# EAGLE board Attenuverting_LinExp_VCA_Bottom (EAGLE 8.3.2)
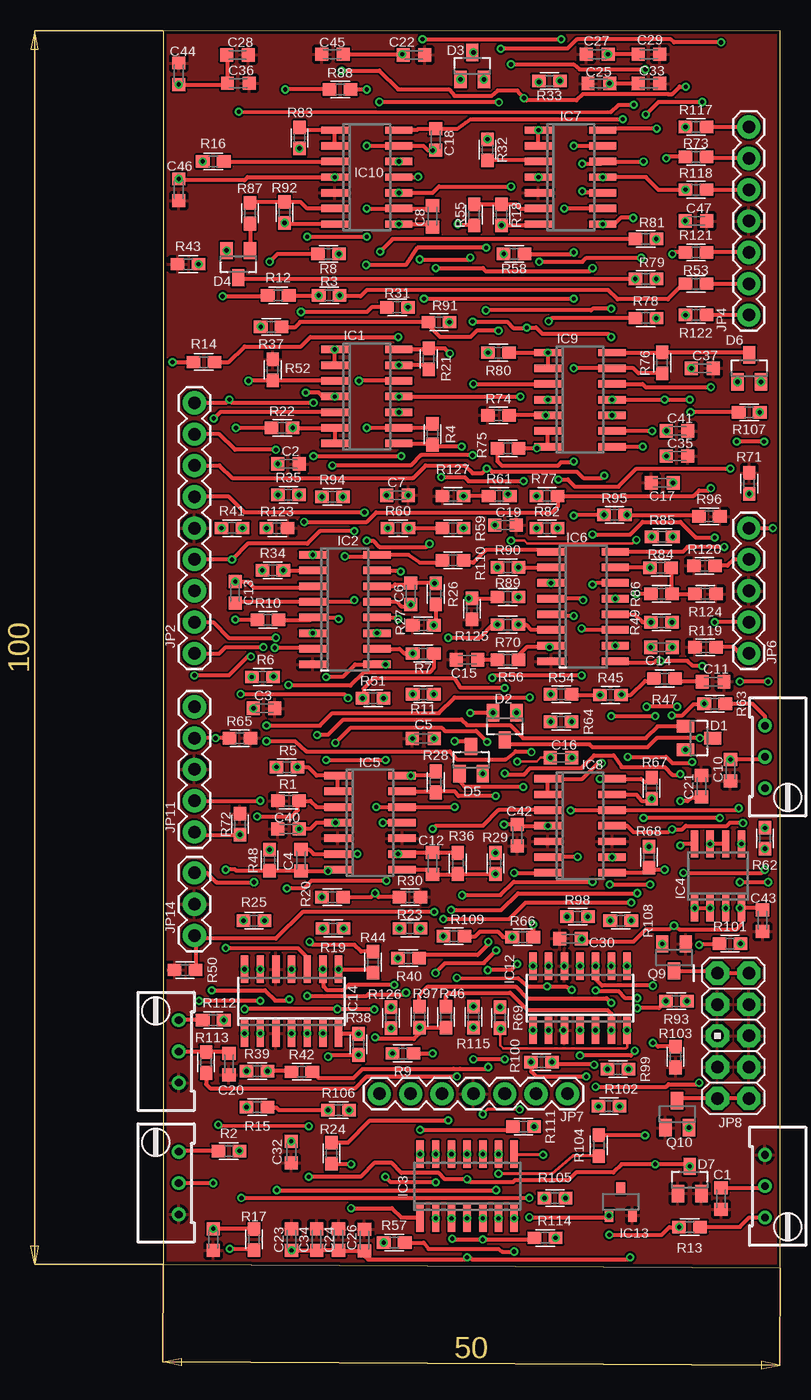
[diagram p5: board, top side]
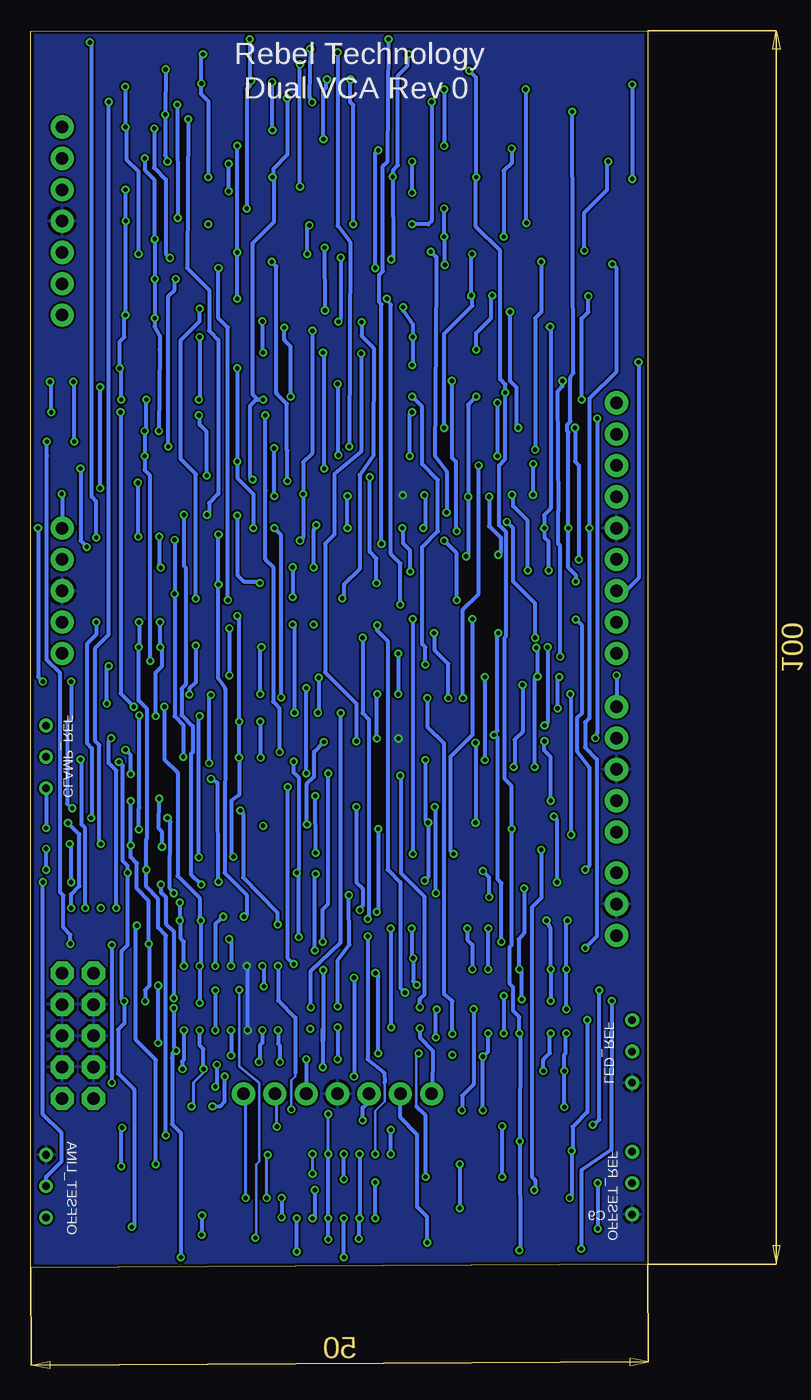
[diagram p6: board, bottom side, seen from below]

Size 50 x 100.25 mm. Coordinates in mm from the lower left corner, seen from the top.
Outline: 0,0.25 50,0 50,100.22 0,100.25 0,0.25
Copper layers (1*16): Top 0.035mm / dielectric 1.5mm / Bottom 0.035mm
Design rules "SeeedStudio_2layer_DRU_no_angle_20140221": minimum track width 6mil, minimum drill 12mil, track to track 6mil, track to pad 6mil, pad to pad 6mil, via to via 6mil, smd to smd 0mil, copper to edge 10mil, drill to drill 10mil, minimum pad ring 10mil, minimum via ring 6mil, stop-mask expansion 2mil, vias tented up to drill 100mil, thermal gap 10mil

## Footprints (pad centres in the part's own frame; a part is rotated, then mirrored left to right if it is on the bottom)
C0603K = smd 1.05 x 1.08: 1 -0.875,0; 2 0.875,0
RTRIM64W = drill 0.61: 1 1.27,-2.54; 2 1.27,0; 3 1.27,2.54
SOT23 = smd 1 x 1.4: 1 -0.95,-1.1; 2 0.95,-1.1; 3 0,1.1
SO14 = smd 0.6 x 2.2: 1 -3.81,-2.6; 2 -2.54,-2.6; 3 -1.27,-2.6; 4 0,-2.6; 5 1.27,-2.6; 6 2.54,-2.6; 7 3.81,-2.6; 8 3.81,2.6; 9 2.54,2.6; 10 1.27,2.6; 11 0,2.6; 12 -1.27,2.6; 13 -2.54,2.6; 14 -3.81,2.6
SOIC16N = smd 0.6 x 2.2: 1 -4.445,-2.6; 2 -3.175,-2.6; 3 -1.905,-2.6; 4 -0.635,-2.6; 5 0.635,-2.6; 6 1.905,-2.6; 7 3.175,-2.6; 8 4.445,-2.6; 9 4.445,2.6; 10 3.175,2.6; 11 1.905,2.6; 12 0.635,2.6; 13 -0.635,2.6; 14 -1.905,2.6; 15 -3.175,2.6; 16 -4.445,2.6
SO08 = smd 0.6 x 2.2: 1 -1.905,-2.6; 2 -0.635,-2.6; 3 0.635,-2.6; 4 1.905,-2.6; 5 1.905,2.6; 6 0.635,2.6; 7 -0.635,2.6; 8 -1.905,2.6
DBZ_R-PDSO-G3 = smd 0.7 x 1: 1 -0.95,-1.1; 2 0.95,-1.1; 3 0,1.1
1X09 = drill 1.016 pad 1.88: 1 0,0; 2 2.54,0; 3 5.08,0; 4 7.62,0; 5 10.16,0; 6 12.7,0; 7 15.24,0; 8 17.78,0; 9 20.32,0
1X07 = drill 1.016 pad 1.88: 1 0,0; 2 2.54,0; 3 5.08,0; 4 7.62,0; 5 10.16,0; 6 12.7,0; 7 15.24,0
1X05 = drill 1.016 pad 1.88: 1 0,0; 2 2.54,0; 3 5.08,0; 4 7.62,0; 5 10.16,0
AVR_ICSP = drill 1.016 pad 1.88 octagon: 1 -1.27,5.08; 2 1.27,5.08; 3 -1.27,2.54; 4 1.27,2.54; 5 -1.27,0; 6 1.27,0; 7 -1.27,-2.54; 8 1.27,-2.54; 9 -1.27,-5.08; 10 1.27,-5.08
1X03 = drill 1.016 pad 1.88: 1 0,0; 2 2.54,0; 3 5.08,0
0603 = smd 1.1 x 1: 1 -0.85,0; 2 0.85,0

## Placement (x,y rotation side)
C1  4u7  [C0603K]  45.21,5.59 270 top
C2  560p  [C0603K]  10.16,65.15 0 top
C3  560p  [C0603K]  8.19,45.34 0 top
C4  100p  [C0603K]  11.18,33.02 90 top
C5  560p  [C0603K]  21.08,42.89 180 top
C6  100p  [C0603K]  20.07,54.61 270 top
C7  560p  [C0603K]  18.99,62.61 0 top
C8  100p  [C0603K]  21.84,85.22 90 top
C9  4u7  [C0603K]  4.06,2.29 270 top
C10  4u7  [C0603K]  45.97,40.32 270 top
C11  560p  [C0603K]  44.58,47.5 0 top
C12  100p  [C0603K]  21.84,32.77 90 top
C13  100p  [C0603K]  5.84,54.74 270 top
C14  100p  [C0603K]  40.39,50.29 180 top
C15  560p  [C0603K]  24.64,49.28 180 top
C16  100p  [C0603K]  32.26,41.34 0 top
C17  560p  [C0603K]  40.45,63.63 180 top
C18  100p  [C0603K]  22.1,91.44 270 top
C19  560p  [C0603K]  27.75,60.2 0 top
C20  4u7  [C0603K]  5.33,16.51 270 top
C21  100n  [C0603K]  43.62,39.02 90 top
C22  100n  [C0603K]  20.32,98.3 180 top
C23  100n  [C0603K]  10.41,2.29 90 top
C24  100n  [C0603K]  14.22,2.29 90 top
C25  100n  [C0603K]  35.31,95.98 180 top
C26  100n  [C0603K]  16.32,2.22 90 top
C27  100n  [C0603K]  35.18,98.36 180 top
C28  100n  [C0603K]  6.03,98.3 0 top
C29  100n  [C0603K]  39.37,98.36 0 top
C30  100n  [C0603K]  33.02,26.67 180 top
C32  100n  [C0603K]  10.38,9.37 270 top
C33  100n  [C0603K]  39.37,95.98 0 top
C34  100n  [C0603K]  12.45,2.29 90 top
C35  100n  [C0603K]  41.66,65.79 0 top
C36  100n  [C0603K]  6.1,96.01 0 top
C37  100n  [C0603K]  43.69,72.9 0 top
C40  100n  [C0603K]  10.16,35.56 180 top
C41  100n  [C0603K]  41.66,67.82 0 top
C42  100n  [C0603K]  28.7,35.05 270 top
C43  100n  [C0603K]  48.58,28.13 90 top
C44  100n  [C0603K]  1.27,96.77 90 top
C45  100n  [C0603K]  13.72,98.36 180 top
C46  100n  [C0603K]  1.27,87.38 270 top
C47  100n  [C0603K]  43.18,84.84 0 top
CLAMP_REF  [RTRIM64W]  50.04,41.4 180 top
D1  BAT54A  [SOT23]  43.43,42.93 270 top
D2  BAT54A  [SOT23]  27.69,43.88 180 top
D3  BAT54S  [SOT23]  25.05,97.41 0 top
D4  BAT54S  [SOT23]  6.1,81.34 180 top
D5  BAT54S  [SOT23]  24.96,41.15 0 top
D6  BAT54S  [SOT23]  47.5,72.9 0 top
D7  BAT54A  [SOT23]  42.67,7.11 0 top
IC1  TL074D  [SO14]  16.51,70.61 270 top
IC2  SSM2164S  [SOIC16N]  14.73,53.34 270 top
IC3  TL074D  [SO14]  24.64,6.6 0 top
IC4  TL072D  [SO08]  44.96,31.75 0 top
IC5  TL074D  [SO14]  16.76,36.07 270 top
IC6  SSM2164S  [SOIC16N]  34.04,53.59 270 top
IC7  TL074D  [SO14]  33.02,88.39 270 top
IC8  TL074D  [SO14]  33.78,35.81 270 top
IC9  TL074D  [SO14]  33.78,70.36 270 top
IC10  TL074D  [SO14]  16.51,88.39 270 top
IC12  QUAD_OPAMPD  [SO14]  33.78,21.84 0 top
IC13  LM4041C12DBZ  [DBZ_R-PDSO-G3]  37.08,5.33 0 top
IC14  QUAD_OPAMPD  [SO14]  10.41,21.59 0 top
JP2  M09  [1X09]  2.54,49.78 90 top
JP4  [1X07]  47.46,77.22 90 top
JP6  [1X05]  47.46,49.78 90 top
JP7  [1X07]  17.53,14.1 0 top
JP8  M05X2PTH  [AVR_ICSP]  46.19,18.8 0 top
JP11  [1X05]  2.54,35.31 90 top
JP14  [1X03]  2.54,26.92 90 top
LED_REF  [RTRIM64W]  0,17.53 0 top
OFFSET_LINA  [RTRIM64W]  50.04,6.6 180 top
OFFSET_REF  [RTRIM64W]  0,6.86 0 top
Q9  BSS84  [SOT23]  41.4,25.15 180 top
Q10  BSS123  [SOT23]  41.66,12.45 0 top
R1  1M  [0603]  10.16,37.85 180 top
R2  10k  [0603]  5.33,9.46 0 top
R3  10k  [0603]  13.46,78.8 0 top
R4  10k  [0603]  21.84,67.56 270 top
R5  30k  [0603]  10.03,40.58 180 top
R6  500  [0603]  8.06,47.88 0 top
R7  30k  [0603]  21.08,49.78 180 top
R8  4k7  [0603]  13.4,82.17 180 top
R9  10k  [0603]  19.43,17.37 180 top
R10  30k  [0603]  8.51,52.51 180 top
R11  500  [0603]  21.08,46.48 180 top
R12  10k  [0603]  9.33,78.8 180 top
R13  10k  [0603]  42.67,3.3 180 top
R14  4k7  [0603]  3.3,73.41 180 top
R15  100k  [0603]  7.62,13.02 180 top
R16  100k  [0603]  4.06,89.66 0 top
R17  10k  [0603]  7.37,2.29 90 top
R18  100k  [0603]  27.43,85.34 270 top
R19  100k  [0603]  13.78,27.5 180 top
R20  10k  [0603]  13.72,30.04 0 top
R21  10k  [0603]  21.53,73.66 90 top
R22  10k  [0603]  9.65,68.07 180 top
R23  100k  [0603]  20,27.5 0 top
R24  2k7  [0603]  13.65,9.27 270 top
R25  10k  [0603]  7.37,28.13 0 top
R26  100k  [0603]  22.1,54.61 90 top
R27  100k  [0603]  21.08,52.07 180 top
R28  10k  [0603]  22.1,39.37 90 top
R29  10k  [0603]  26.92,32.77 90 top
R30  10k  [0603]  20,30.04 0 top
R31  10k  [0603]  18.99,77.85 0 top
R32  100k  [0603]  26.29,90.61 270 top
R33  100k  [0603]  31.31,96.2 180 top
R34  140k  [0603]  8.89,56.52 0 top
R35  500  [0603]  10.16,62.64 0 top
R36  30k  [0603]  23.88,32.77 270 top
R37  100k  [0603]  8.76,76.26 0 top
R38  100k  [0603]  15.84,18.1 270 top
R39  100k  [0603]  7.62,15.94 0 top
R40  100k  [0603]  19.88,25.08 0 top
R41  100k  [0603]  5.59,59.94 0 top
R42  100k  [0603]  11.24,15.88 0 top
R43  100k  [0603]  2.03,81.34 180 top
R44  560  [0603]  17.02,24.77 270 top
R45  30k  [0603]  36.26,46.42 0 top
R46  100k  [0603]  22.92,20.32 270 top
R47  500  [0603]  40.64,47.75 180 top
R48  10k  [0603]  8.64,33.02 270 top
R49  30k  [0603]  40.39,52.32 0 top
R50  1M  [0603]  1.78,24.13 180 top
R51  560  [0603]  17.02,46.16 0 top
R52  1M  [0603]  8.89,72.77 90 top
R53  10k  [0603]  43.18,79.76 180 top
R54  30k  [0603]  32.26,46.48 180 top
R55  100k  [0603]  25.21,85.34 90 top
R56  500  [0603]  27.94,49.28 0 top
R57  2k7  [0603]  18.73,2.03 0 top
R58  100k  [0603]  28.45,82.17 180 top
R59  140k  [0603]  23.5,59.94 180 top
R60  500  [0603]  19.05,59.94 0 top
R61  100k  [0603]  27.24,62.55 0 top
R62  10k  [0603]  48.77,34.8 270 top
R63  10k  [0603]  44.7,45.72 0 top
R64  30k  [0603]  32.26,44.26 180 top
R65  1M  [0603]  6.22,42.93 0 top
R66  10k  [0603]  29.15,26.8 0 top
R67  10k  [0603]  39.59,38.86 90 top
R68  10k  [0603]  39.37,33.27 90 top
R69  560  [0603]  27.3,20.26 270 top
R70  560  [0603]  27.94,52.13 180 top
R71  10k  [0603]  47.5,63.56 90 top
R72  1M  [0603]  6.22,35.94 90 top
R73  10k  [0603]  43.18,90.04 180 top
R74  1M  [0603]  27.18,69.09 180 top
R75  10k  [0603]  27.94,66.42 180 top
R76  10k  [0603]  40.45,73.34 90 top
R77  10k  [0603]  31.11,62.55 0 top
R78  10k  [0603]  39.12,76.96 0 top
R79  10k  [0603]  39.12,80.14 180 top
R80  10k  [0603]  27.18,74.17 180 top
R81  4k7  [0603]  39.12,83.38 180 top
R82  4k7  [0603]  31.11,59.94 180 top
R83  100k  [0603]  11.05,91.57 90 top
R84  140k  [0603]  40.32,56.74 180 top
R85  500  [0603]  40.45,59.25 180 top
R86  100k  [0603]  40.39,54.61 180 top
R87  100k  [0603]  7.05,85.47 90 top
R88  100k  [0603]  14.35,95.5 180 top
R89  140k  [0603]  27.94,54.36 0 top
R90  500  [0603]  27.94,56.77 0 top
R91  100k  [0603]  22.35,76.64 180 top
R92  100k  [0603]  9.84,85.53 270 top
R93  510  [0603]  41.59,21.59 180 top
R94  6k  [0603]  13.72,62.48 0 top
R95  100k  [0603]  36.58,61.02 180 top
R96  100k  [0603]  44.26,60.9 0 top
R97  100k  [0603]  20.76,20.32 270 top
R98  100k  [0603]  33.59,28.45 180 top
R99  100k  [0603]  36.86,16.1 180 top
R100  100k  [0603]  30.67,16.67 0 top
R101  100k  [0603]  45.94,26.26 0 top
R102  100k  [0603]  36.13,13.08 180 top
R103  100k  [0603]  41.53,17.08 270 top
R104  10k  [0603]  35.31,9.91 270 top
R105  2k7  [0603]  31.75,5.65 0 top
R106  100k  [0603]  14.22,12.76 0 top
R107  100k  [0603]  47.5,69.34 0 top
R108  100k  [0603]  37.08,28.13 180 top
R109  10k  [0603]  23.56,26.86 0 top
R110  6k  [0603]  23.5,57.34 180 top
R111  2k7  [0603]  29.21,11.43 0 top
R112  10k  [0603]  4.06,20.07 0 top
R113  10k  [0603]  3.49,16.64 90 top
R114  10k  [0603]  30.96,2.41 0 top
R115  1k  [0603]  25.15,20.32 270 top
R117  10k  [0603]  43.18,92.46 0 top
R118  10k  [0603]  43.18,87.38 180 top
R119  10k  [0603]  43.94,50.29 180 top
R120  10k  [0603]  43.88,56.9 180 top
R121  10k  [0603]  43.18,82.3 0 top
R122  10k  [0603]  43.18,77.22 180 top
R123  100k  [0603]  9.24,59.94 180 top
R124  100k  [0603]  43.94,54.61 180 top
R125  100k  [0603]  25.02,53.4 90 top
R126  1k  [0603]  18.48,20.26 270 top
R127  100k  [0603]  23.5,62.55 0 top

## Tracks (layer width: path | path; a pad name or v marks a point on that pad's centre or on a via)
+12V  (via drill 0.35)
  Top 0.305: C40.1 11.94,35.56 12.45,36.07 v13.97,36.07 IC5.4 | IC10.4 6.86,88.39 6.6,88.14 1.38,88.14 C46.1 | 42.99,34.29 IC4.8 42.03,34.35 v41.91,34.23 | v14.73,57.66 17.2,57.66 IC2.16 19.88,57.78 20.83,57.15 22.33,57.15 22.39,57.09 R110.2 | R121.1 41.4,82.3 v41.27,82.17 | IC8.4 28.82,35.81 C42.1 | C23.1 C34.1 C24.1 14.29,1.35 C26.1 16.32,0.95 16.61,0.66 24.46,0.66 v24.64,0.83 24.85,0.83 25.02,0.66 37.67,0.66 v37.85,0.83 | v38.42,21.04 40.19,21.04 R93.2 | v38.22,17.58 38.23,17.53 37.9,17.2 v33.78,17.2 | v41.91,37.81 42.51,37.81 42.83,38.13 43.61,38.13 C21.1 | C28.1 5.22,98.23 C36.1 5.11,95.9 C44.1 | v32.04,63.88 32.8,63.88 33.37,63.31 36.89,63.31 38.35,64.77 v45.97,64.77 | v45.47,58.42 42.51,58.42 42.1,58.01 36.67,58.01 IC6.16 | v14.48,97.03 17.53,97.03 19.05,95.5 23.18,95.5 23.63,94.99 26.63,94.99 27.11,95.41 28.7,95.41 v29.24,94.81 29.43,94.62 33.5,94.62 34.02,95.14 40.9,95.14 | v11.56,70.93 12.61,70.93 12.89,70.64 13.88,70.64 IC1.4 | v42.35,95.73 41.85,95.73 41.26,95.14 40.9,95.14 | 40.9,95.14 | C42.1 28.05,35.93 | C42.1 v27.62,35.93 | v13.97,42.54 15.16,43.74 22.61,43.74 22.84,43.51 25.36,43.51 v26.26,42.61
  Bottom 0.305: R93.2 40.74,22.5 40.39,22.86 40.39,26.18 Q9.2 40.45,29.72 41.4,30.73 41.4,32.77 41.91,33.27 v41.91,34.23 v41.91,37.81 | IC1.4 14.57,69.96 R94.2 14.57,57.82 v14.73,57.66 | v41.27,82.17 41.27,88.84 42.23,89.79 42.23,92.35 R117.1 42.33,95.7 v42.35,95.73 | v24.64,0.83 IC3.4 | C23.1 10.35,1.47 C32.1 10.35,18.93 IC14.4 10.41,20.32 10.92,20.83 10.92,22.73 11.18,22.99 11.18,26.03 11.05,26.15 11.05,35.54 C40.1 11.04,39.04 11.59,39.59 11.59,51.08 11.48,51.19 11.48,59.61 12.06,60.19 12.06,65.02 11.56,65.52 v11.56,70.93 11.56,71.6 11.97,72.01 11.97,82.42 13.94,84.39 13.94,88.55 13.91,88.58 | IC12.4 v33.78,17.2 | v37.85,0.83 37.85,10.92 38.54,11.62 38.54,16.99 38.54,17.37 v38.22,17.58 38.42,17.84 v38.42,21.04 | C44.1 C46.1 | v32.04,63.88 32.26,64.11 32.26,69.85 31.75,70.36 IC9.4 31.62,70.36 32.04,70.77 32.04,83.03 30.29,84.77 30.29,88.26 IC7.4 30.35,88.46 30.35,89.06 29.21,90.2 v29.24,94.81 | v45.97,64.77 45.97,58.93 v45.47,58.42 | 13.91,88.58 IC10.4 | 13.91,88.58 13.91,96.46 v14.48,97.03 | v27.62,35.93 27.62,39.23 27.05,39.81 27.05,41.81 v26.26,42.61 | v13.97,42.54 v13.97,36.07
  other vias: 40.74,21.59 40.45,26.25 14.57,62.48 13.91,70.61 42.33,92.46 10.38,10.24 10.41,18.99 24.64,4 10.41,1.41 33.78,19.24 31.18,70.36 30.42,88.39 1.27,95.9 1.27,88.25 31.18,35.81 13.91,88.39 11.04,35.56
-10V  (via drill 0.35)
  Bottom 0.305: 7.87,75.95 8.19,76.26 R37.1 7.87,76.23 7.87,61.53 8.41,60.99 8.41,59.97 R123.2 | R123.2 8.64,59.91 | R123.2 8.35,59.91 8.35,59.15 8.04,58.84 R34.1
  other vias: 8.04,56.52 8.39,59.94 7.91,76.26
-10V1  (via drill 0.35)
  Top 0.305: R61.1 v24.34,62.55
  Bottom 0.305: v24.34,59.94 v24.34,62.55
-10V2  (via drill 0.35)
  Top 0.305: R89.1 26.99,54.25 R125.2 v24.77,54.25
  Bottom 0.305: R91.1 23.2,75.53 22.23,74.55 22.25,65.83 23.37,64.26 23.37,56.64 24.64,55.37 24.64,54.38 v24.77,54.25
  other vias: 23.2,76.64
-10V3
  Top 0.305: 41.26,54.61 R124.2 | 41.26,54.61 R86.1 | R84.1 41.17,54.69 41.26,54.61
-12V  (via drill 0.35)
  Top 0.305: IC4.4 48.43,29.15 C43.2 | IC1.11 v28.96,70.61 | v36.32,75.44 36.07,75.69 30.73,75.69 30.23,76.2 v29.46,76.2 29.43,76.17 28.38,76.17 27.88,76.68 v25.08,76.68 | v43.69,48.77 42.93,48.77 42.48,49.18 v40.32,49.18 39.94,49.18 39.78,49.02 36.76,49.02 IC6.9 | IC9.11 v40.64,70.36 v42.67,70.36 | IC7.11 39.12,88.39 40.13,87.38 R118.2 | IC4.4 46.86,27.81 46.48,27.43 41.81,27.43 41.5,27.65 v41.4,27.72 41.37,27.72 41.02,27.43 39.12,27.43 38.1,26.42 34.15,26.42 v33.94,26.63 C30.1 | 18.1,48.83 v18.03,48.89 IC2.9 15.56,48.89 14.54,47.88 v13.21,47.88 | v13.21,41.15 v18.03,41.15 | IC5.11 v17.81,36.07 | v18.1,31.37 12.06,31.37 11.43,30.73 v10.03,30.73 | IC8.11 37.59,35.81 38.1,35.31 40.93,35.31 v41.24,35.53 42.07,35.53 42.35,35.81 45.69,35.81 45.94,36.07 46.96,36.07 v46.99,36.04 | v41.21,44.77 42.07,44.77 42.99,45.69 43.82,45.69 R63.1 | D7.3 42.5,8.38 v39.88,8.38 37.15,8.38 36.48,7.71 33.47,7.71 32.83,7.08 28.51,7.08 28.35,6.92 24.89,6.92 v24.64,7.18 22.83,7.18 22.32,7.68 19.3,7.68 18.51,8.48 17.11,8.48 16,7.37 v11.81,7.37 | v11.81,11.46 4.57,11.49 v4.48,11.59 | v3.94,22.48 8.26,22.48 9.08,21.65 9.87,21.65 v10.22,21.75 | IC4.4 v46.74,29.15 | C29.1 C27.1 | C33.1 C25.1 | C45.1 v19.38,98.36 C22.2 | IC10.11 20.64,88.39 v20.67,88.42 | v20.8,81.73 24.73,81.73 v24.89,81.88
  Bottom 0.305: v28.96,70.61 28.96,74.68 29.46,75.18 v29.46,76.2 | v36.32,75.44 36.32,70.42 IC9.11 | R63.1 43.85,48.6 v43.69,48.77 | v40.64,70.36 40.64,67.96 C41.1 C35.1 40.78,64.66 40.39,64.26 40.39,49.34 v40.32,49.18 | v42.67,70.36 42.67,72.76 C37.1 42.81,75.04 42.42,75.44 42.42,77.13 R122.2 42.33,84.81 C47.1 42.3,87.35 R118.2 | D7.3 42.67,11.28 Q10.2 | v13.21,47.88 v13.21,41.15 | v18.03,41.15 18.03,36.29 v17.81,36.07 17.81,31.66 v18.1,31.37 | IC12.11 33.78,26.48 v33.94,26.63 | v10.03,30.73 10.03,27.15 10.48,26.61 10.48,24.25 IC14.11 10.41,24.07 10.26,23.91 10.22,23.91 v10.22,21.75 | v41.24,35.53 41.24,37.24 41.21,37.27 v41.21,44.77 | v24.64,7.18 IC3.11 | v41.4,27.72 41.5,27.4 41.5,18.45 39.88,16.83 v39.88,8.38 | v11.81,7.37 v11.81,11.46 | v4.48,11.59 4.35,11.59 3.94,12 v3.94,22.48 | v46.74,29.15 46.74,30.26 46.07,30.93 46.07,35.11 v46.99,36.04 | v18.03,48.89 18.03,50.29 18.29,50.55 18.29,58.42 17.02,59.69 17.02,63.85 18.29,65.12 18.29,69.79 IC1.11 | C27.1 36.18,98.23 C25.1 36.2,95.81 36.2,95.12 35.62,94.55 IC7.11 | v19.38,98.36 19.46,98.28 19.46,97.41 20.26,96.62 20.26,89.34 20.67,88.93 v20.67,88.42 20.64,81.89 v20.8,81.73 | v24.89,81.88 24.89,76.87 v25.08,76.68
  other vias: 42.61,11.35 36.38,70.36 43.85,45.72 40.78,67.82 42.81,72.9 42.33,77.22 42.3,84.84 42.33,87.38 40.78,65.79 42.67,8.21 33.78,24.44 10.41,24.19 24.64,9.2 19.11,70.61 36.18,95.98 36.05,98.36 35.62,88.39
CLAMP_REF  (via drill 0.35)
  Top 0.305: IC4.2 v43.08,29.15 IC4.1 | D1.3 v43.5,42.93 40.01,42.93 39.24,42.16 34.8,42.16 34.54,42.42 28.05,42.42 D2.3
  Bottom 0.305: v43.08,29.15 43.08,40.28 43.69,40.89 43.69,42.67 v43.5,42.93
  other vias: 44.32,29.15
CV_1+  (via drill 0.35)
  Top 0.305: 13.91,67.88 IC1.6 | 13.91,67.88 IC1.7 | R22.1 13.71,68.07 13.91,67.88 | R31.1 16.89,77.85 16.51,77.47 v11.18,77.47
  Bottom 0.305: v11.18,77.47 11.18,71.88 10.67,71.37 10.67,68.24 R22.1
  other vias: 10.5,68.07
CV_1+1  (via drill 0.35)
  Top 0.305: 31.18,66.69 IC9.6 | 31.18,66.69 IC9.7 | R75.1 v30.29,66.42 30.91,66.42 31.18,66.69
  Bottom 0.305: v30.29,66.42 30.27,66.4 v30.27,62.55
CV_1-  (via drill 0.35)
  Top 0.305: IC1.2 IC1.1 | R12.1 R3.1
  Bottom 0.305: IC1.1 13.91,75.75 12.7,76.96 12.7,78.72 R3.1
  other vias: 12.61,78.8 13.91,74.42
CV_1-1  (via drill 0.35)
  Top 0.305: IC9.2 IC9.1 R80.1 | v31.24,76.71 31.5,76.96 R78.1
  Bottom 0.305: v31.24,76.71 31.24,74.23 IC9.1
  other vias: 31.18,74.17
CV_EXPA  (via drill 0.35)
  Top 0.305: R65.1 v4.25,42.93 JP11.4 | IC1.5 4.61,69.34 v4.11,68.83
  Bottom 0.305: v4.11,68.83 4.11,43.39 v4.25,42.93
CV_EXPB  (via drill 0.35)
  Top 0.305: IC9.5 v31.01,69.09 R74.1 | JP11.2 v7.87,37.85 | v8.38,42.67 10.67,42.67 11.62,41.85 23.24,41.85 23.81,41.21 27.75,41.21 28.57,41.85 29.78,41.85 v29.84,41.79
  Bottom 0.305: v7.87,37.85 7.87,41.4 8.38,41.91 v8.38,42.67 | 30.99,69.07 v31.01,69.09 31.02,68.35 31.02,63.85 30.99,62.99 30.99,57.4 30.38,56.79 30.38,45.87 29.84,45.34 v29.84,41.79
CV_LINA  (via drill 0.35)
  Top 0.305: IC1.3 13.87,71.92 R52.1 6.96,71.92 v6.92,71.88 | v7.11,49.53 6.86,49.53 5.33,48.01 v2.54,48.01
  Bottom 0.305: v6.92,71.88 6.92,71.44 7.3,71.06 7.24,61.34 7.27,61.31 7.27,58.67 7.11,58.52 v7.11,49.53 | v2.54,48.01 JP11.5
CV_LINB  (via drill 0.35)
  Top 0.305: R72.1 2.75,35.09 JP11.1 | v25.15,71.63 IC9.3 | v25.08,65.85 20.89,65.85 20.07,65.02 v13.72,65.02 | v6.29,46.48 14.67,46.48 v14.99,46.16
  Bottom 0.305: R72.1 6.22,46.1 v6.29,46.48 | v14.99,46.16 14.99,53.34 13.72,54.61 v13.72,65.02 | v25.08,65.85 25.08,71.57 v25.15,71.63
  other vias: 6.22,35.09
CV_SUM+_A  (via drill 0.35)
  Top 0.305: R38.1 14.27,18.95 IC14.7
  Bottom 0.305: R51.2 17.87,43.84 16.51,42.48 16.51,22.16 15.84,21.62 R38.1
  other vias: 17.87,46.16 15.84,18.95
CV_SUM+_B  (via drill 0.35)
  Top 0.203: R69.2 27.3,18.03 27.56,17.78 37.5,17.78 37.59,17.84 IC12.7
  Top 0.305: R69.2 v27.36,19.35
  Bottom 0.305: IC12.7 37.59,16.86 37.75,16.7 37.75,16.14 R99.1
  other vias: 37.59,19.24 37.71,16.1
CV_SUM-_A  (via drill 0.35)
  Top 0.305: 14.28,24.13 IC14.8 17.29,24.19 R44.2
  Bottom 0.305: R19.1 14.63,26.57 14.22,26.16 IC14.8
  other vias: 14.63,27.5 14.22,24.19
CV_SUM-_B  (via drill 0.35)
  Top 0.305: R70.2 26.73,52.13 25.65,51.05 v23.11,51.05 | v22.7,28.26 28.04,28.26 29.37,29.59 v37.94,29.59
  Bottom 0.305: IC12.8 37.59,26.42 37.85,26.67 37.85,28.36 R108.1 37.94,29.46 v37.94,29.59 | v23.11,51.05 23.11,44.96 22.61,44.45 22.61,28.45 v22.7,28.26
  other vias: 37.93,28.13 37.59,24.44 27.09,52.13
EXP_NEG_A  (via drill 0.35)
  Top 0.305: 26.35,26.32 v26.35,26.42 26.35,26.19 25.5,25.34 20.98,25.34 R40.2
  Bottom 0.305: D5.2 25.91,40.3 25.91,29.46 26.35,29.02 v26.35,26.42
  other vias: 25.91,40.05
EXP_NEG_B  (via drill 0.35)
  Bottom 0.305: R107.2 48.35,71.7 D6.2
  other vias: 48.35,69.34 48.45,71.8
EXP_POS_A  (via drill 0.35)
  Top 0.305: R42.2 12.6,15.37 15.43,15.37 16.16,16.1 23.55,16.12 23.55,16.13 24.07,16.13 24.08,16.12 26.23,16.13 v26.35,16.26 | v29.18,38.96 24.45,38.96 24.13,39.37 24.13,40.18 D5.1 | v28.7,24.61 28.23,24.13 26.33,24.13 v26.31,24.11
  Bottom 0.305: 26.35,18.36 v26.35,16.26 | 26.35,18.36 26.35,19.3 | v29.18,38.96 29.21,38.99 29.21,25.11 v28.7,24.61 | v26.31,24.11 26.31,18.4 26.35,18.36
EXP_POS_B  (via drill 0.35)
  Top 0.305: v48.7,66.96 v46.48,66.96
  Bottom 0.305: R101.2 46.79,26.98 47.37,27.56 47.37,30.16 47.62,30.42 47.62,48.19 48.7,49.27 48.7,65.81 | 48.7,65.81 | 48.7,65.81 v48.7,66.96 | v46.48,66.96 46.48,71.73 D6.1
  other vias: 46.55,71.8 46.79,26.26
GND  (via drill 0.35)
  Top 0.152: IC12.3 v32.44,19.24
  Bottom 0.305: v32.44,19.24 32.44,24.37 IC12.12
  other vias: 19.86,62.61 20.21,42.89 32.51,24.44
  pour Bottom: -3.56,102.11 52.32,102.11 52.32,-1.78 -3.56,-1.78
  pour Top: -2.03,101.6 51.31,101.6 51.31,-0.76 -2.03,-0.76
IC2_2  (via drill 0.35)
  Top 0.305: R46.1 22.92,22.03 23.18,22.29 28.13,22.29 29.53,20.89 36,20.89 36.06,20.83 36.32,20.57 IC12.6
  Bottom 0.254: R99.2 36.04,15.77 36.83,14.99 36.83,13.23 R102.1
  Bottom 0.305: IC12.6 36.32,18.03 36.01,17.72 R99.2
  other vias: 36.98,13.08 36.01,16.1 36.32,19.24
IC2_4  (via drill 0.35)
  Top 0.305: C13.2 5.96,53.97 IC2.4 15.37,53.97 v15.49,54.1 | IC7.9 v32.51,85.85 | v16.51,58.93 17.02,58.93 17.53,58.42 21.34,58.42 v21.59,58.67 | v21.02,99.57 v32.26,99.57
  Bottom 0.305: v32.51,85.85 32.51,95.53 32.26,95.78 | 32.26,95.78 R33.1 | v15.49,54.1 15.49,57.91 v16.51,58.93 | v21.59,58.67 21.59,78.1 21.78,78.29 21.78,80.45 21.47,80.76 21.47,89.28 21.08,89.66 v21.02,99.57 | v32.26,99.57 32.26,95.78
  other vias: 32.16,96.2
IC2_8  (via drill 0.35)
  Top 0.305: R106.1 9.4,12.76 9.21,12.95 8.53,12.95 R15.1 | R38.2 13.52,17.25 v13.37,17.11
  Bottom 0.305: R106.1 v13.37,17.11 12.95,17.53 IC14.6
  other vias: 13.37,12.76 12.95,18.99 15.84,17.25
IC2_13  (via drill 0.35)
  Top 0.305: R58.1 33.15,82.17 v33.27,82.3 | v33.27,90.93 IC7.13 | IC2.13 18.92,53.97 19.3,53.59 19.93,53.59 C6.2 | v21.14,78.55 v33.27,78.55
  Bottom 0.305: v33.27,90.93 v33.27,82.3 v33.27,78.55 | C6.2 20.07,57.09 20.83,57.85 20.83,78.04 v21.14,78.55
  other vias: 20.07,53.73
IC2B_1  (via drill 0.35)
  Top 0.305: IC6.6 29.84,51.69 29.46,52.07 28.85,52.07 R70.1
  Bottom 0.305: D2.1 28.64,51.98 R70.1
  other vias: 28.64,44.98 28.79,52.13
IC2B_6  (via drill 0.35)
  Top 0.305: R44.1 16.04,25.62 15.49,26.16 12.13,26.16 v11.87,26.42 | D1.1 40.07,43.88 39.12,42.93 29.17,42.93 28.12,43.97 26.11,43.97 | v12.48,43.18 13.34,43.18 14.61,44.42 24.16,44.45 24.64,43.97 26.11,43.97 | 26.11,43.97
  Bottom 0.305: v11.87,26.42 11.87,31.15 12.19,31.5 12.19,42.96 v12.48,43.18 12.19,43.53 12.19,51.38 IC2.6
  other vias: 12.13,51.43
IC2C_1  (via drill 0.35)
  Top 0.305: D2.2 24.91,44.98 v24.89,44.96 | v33.91,48.01 26.86,48.01 v26.67,47.82 | IC6.11 34.04,51.69 v33.91,51.82
  Bottom 0.305: R69.1 27.3,24.07 24.89,26.35 v24.89,44.96 | v33.91,51.82 v33.91,48.01 | v26.67,47.82 26.67,45.04 D2.2
  other vias: 27.3,21.11 26.74,44.98
IC2C_11  (via drill 0.35)
  Top 0.305: R51.1 16,46.48 15.75,46.23 15.91,46.23 R51.1 | v27.69,46.99 24.13,46.99 23.62,47.75 17.02,47.75 16.26,46.93 16.26,46.57 R51.1 | v27.69,40.07 27.81,39.94 29.21,39.94 29.76,40.49 33.89,40.49 34.92,41.53 36.51,41.53 37.15,40.58 40.64,40.58 41.27,39.94 41.85,39.94 v41.91,40
  Bottom 0.305: R51.1 16.17,48.93 17.27,50.04 17.27,51.38 IC2.11 | v27.69,40.07 v27.69,46.99 | v41.91,40 41.91,41.55 D1.2
  other vias: 16.17,46.16 17.33,51.43 42.33,41.98
IC6_4  (via drill 0.35)
  Top 0.305: C18.2 v21.84,90.57 21.45,90.57 21.08,90.93 IC10.13 v16.51,90.93 | R88.1 v16.51,95.5 | IC6.4 33.91,54.23 v34.04,54.1 | v22.1,81.03 25.91,81.03 26.16,80.77 34.54,80.77 v34.8,81.03
  Bottom 0.305: v16.51,95.5 v16.51,90.93 | v34.04,54.1 34.04,76.2 34.8,76.96 v34.8,81.03 | v22.1,81.03 22.1,90.31 v21.84,90.57
IC6_13  (via drill 0.35)
  Top 0.305: C8.2 21.6,85.85 IC10.9 v16.51,85.85 | v11.68,83.57 v16.51,83.57 | v36.32,77.72 34.8,77.72 34.67,77.6 v26.16,77.6 | v26.19,82.68 20.61,82.68 19.65,81.28 v16.45,81.28
  Bottom 0.305: R83.1 11.05,89.54 11.68,88.9 v11.68,83.57 | v16.51,85.85 v16.51,83.57 16.45,83.5 v16.45,81.28 | IC6.13 36.64,64.32 37.85,65.53 37.85,75.18 36.32,76.71 v36.32,77.72 | v26.16,77.6 v26.19,82.68
  other vias: 11.05,90.72 36.64,54.23
IN1  (via drill 0.35)
  Top 0.305: R45.1 33.17,46.42 R54.1 | IC8.2 IC8.1 33.98,39.62 35.25,40.89 35.24,40.89 v35.56,40.89
  Bottom 0.305: v35.56,40.89 35.56,46.25 R45.1
  other vias: 35.41,46.42
IN2  (via drill 0.35)
  Top 0.305: R5.1 11.75,40.58 12.45,39.88 IC5.1 IC5.2 | R7.1 21.93,48.6 21.59,48.26 16.26,48.26 15.18,47.18 10.22,47.18 v10.16,47.24
  Bottom 0.305: v10.16,47.24 10.16,43.43 10.79,42.8 10.79,40.66 R5.1
  other vias: 10.88,40.58
IN_A  (via drill 0.35)
  Top 0.305: IC5.3 12.45,37.34 11.94,37.85 R1.1 10.92,37.76 10.92,37.08 10.41,36.58 v7.62,36.58 | JP14.3 3.56,32 4.32,31.24 v7.37,31.24
  Bottom 0.305: v7.37,31.24 7.37,36.32 v7.62,36.58
IN_B  (via drill 0.35)
  Top 0.305: 2.63,26.84 R50.1 | 2.63,26.84 JP14.1 | IC8.3 27.18,37.08 25.91,35.81 22.1,35.81 v21.84,35.56 | v21.97,28.83 11.3,28.83 9.14,26.67 2.79,26.67 2.63,26.84
  Bottom 0.305: v21.84,35.56 21.84,28.96 v21.97,28.83
INV_A  (via drill 0.35)
  Top 0.305: JP6.2 v44.7,52.32 | v17.27,37.34 IC5.12 v23.62,37.34 | v45.12,36.45 v38.92,36.45 | v23.34,28.99 27.4,28.99 28.77,30.35 v38.42,30.35 | R20.2 16.86,30.04 17.17,30.34 | 17.17,30.34 v17.18,30.35 | R30.1 17.47,30.04 17.17,30.34
  Bottom 0.305: v44.7,52.32 44.7,51.31 45.47,50.55 45.47,42.51 45.05,42.1 45.09,36.48 v45.12,36.45 | v17.18,30.35 17.18,37.3 v17.27,37.34 | v23.62,37.34 23.62,31.24 23.11,30.73 23.11,29.34 v23.34,28.99 | v38.42,30.35 38.73,30.73 38.7,36.13 v38.92,36.45
INV_B  (via drill 0.35)
  Top 0.305: v33.02,37.05 36.35,37.05 IC8.12 46.42,37.08 v46.64,37.24 | JP6.5 v49.42,59.94 | v49.02,47.5 v46.74,47.5
  Top 0.406: R66.2 v30,27.81
  Bottom 0.305: JP6.5 47.46,62.68 R71.1 | v30,27.81 30,28.76 32.8,31.62 32.8,36.83 v33.02,37.05 | v49.42,59.94 49.42,47.89 v49.02,47.5 | v46.74,47.5 46.74,44.48 47.05,44.16 47.05,37.59 v46.64,37.24
  other vias: 47.5,62.71
LED_A+  (via drill 0.35)
  Top 0.305: R24.1 14.95,10.12 16.76,11.94 v23.11,11.94
  Bottom 0.305: v23.11,11.94 23.11,12.95 22.61,13.46 JP7.3
LED_A-  (via drill 0.35)
  Bottom 0.305: R57.1 17.88,4.1 18.7,4.92 18.71,10.77 20.07,12.19 JP7.2
  other vias: 17.88,2.03
LED_B+  (via drill 0.35)
  Bottom 0.254: R105.2 32.6,13.93 JP7.7
  other vias: 32.6,5.65
LED_B-  (via drill 0.35)
  Bottom 0.254: R111.2 30.06,13.93 JP7.6
  other vias: 30.06,11.43
LED_VREF  (via drill 0.35)
  Top 0.254: v28.89,12.82 26.28,12.82 v25.91,12.45
  Top 0.305: v23.43,2.35 23.5,2.29 v25.91,2.29 29.98,2.29 R114.1
  Bottom 0.203: 28.57,15.81 28.57,15.49 28.89,15.18 v28.89,12.82 28.89,12.64
  Bottom 0.254: IC3.10 v25.91,12.45
  Bottom 0.305: v25.91,2.29 IC3.5 IC3.10 | IC12.14 29.97,21.65 28.57,20.26 28.57,15.81 | 23.43,3.94 v23.43,2.35 | 23.43,3.94 IC3.3 | IC3.12 IC3.3 | IC3.3 23.43,3.94
  other vias: 25.91,4 29.97,24.44 25.91,9.2 23.37,4 23.37,9.2
LIN+_OUT_A  (via drill 0.35)
  Top 0.305: IC2.14 18.67,55.24 18.8,55.37 19.95,55.37 C6.1 v21.99,55.48 22.02,55.46 R26.2 | v22.54,64.07 24.45,64.07 24.77,63.75 v29.21,63.75 | v30.48,81.53 33.97,81.53 34.29,81.85 v38.73,81.85 | v40.01,92.33 35.75,92.33 IC7.14
  Bottom 0.305: v21.99,55.48 21.99,57.49 22.54,58.04 v22.54,64.07 | v29.21,63.75 29.21,66.19 29.25,66.23 29.25,70.01 30.1,70.86 30.1,81.15 v30.48,81.53 | v40.01,92.33 40.01,89.15 39.05,88.2 39.05,82.17 v38.73,81.85
LIN+_OUT_B  (via drill 0.35)
  Top 0.305: IC10.14 20.57,92.2 20.69,92.32 C18.1 23.83,92.32 24.89,93.09 v37.24,93.09 | R95.2 33.34,61.02 v33.27,60.96
  Bottom 0.305: v37.24,93.09 37.34,81.03 35.56,79.25 35.56,75.95 34.8,75.18 34.8,62.74 35.56,61.98 35.56,61.19 R95.2 | v33.27,60.96 33.27,56.13 32.77,55.63 31.56,55.63 v31.44,55.5
  other vias: 35.73,61.02
LIN-_OUT_A  (via drill 0.35)
  Top 0.305: C13.1 6.87,55.61 7.37,55.12 12.01,55.12 IC2.3 | v6.13,93.69 36.26,93.66 36.92,94.27 v38.13,94.27 | v38.1,85.09 37.08,85.09 36.58,84.58 IC7.8
  Bottom 0.305: C13.1 5.84,56.13 6.44,56.73 R41.2 6.44,67.71 6.54,67.81 6.54,68.33 6.29,68.58 6.29,72.14 6.03,72.52 v6.13,93.69 | v38.13,94.27 v38.1,85.09
  other vias: 6.44,59.94 5.84,55.61 35.62,84.58
LIN-_OUT_B  (via drill 0.35)
  Top 0.305: IC10.8 21.6,84.58 C8.1 | IC6.14 35.18,55.5 v34.8,55.37 | v34.8,59.44 37.85,59.44 38.86,60.45 41.91,60.45 43.18,59.18 v44.7,59.18 | v45.21,99.31 41.4,99.31 41.15,99.57 33.53,99.57 32.77,98.81 v27.37,98.81 | v27.21,94.46 17.72,94.49 v17.53,94.49
  Bottom 0.305: R98.2 32.51,28.54 32.51,30.23 34.29,32 34.26,46.93 34.8,47.75 v34.8,55.37 v34.8,59.44 | v45.21,99.31 45.09,99.19 45.09,62.48 44.7,62.1 v44.7,59.18 | v27.37,98.81 27.43,94.9 v27.21,94.46 | v17.53,94.49 17.53,84.84 17.78,84.58 IC10.8
  other vias: 32.74,28.45 19.11,84.58
LIN_NEG_A  (via drill 0.35)
  Bottom 0.305: R32.1 26.29,95.44 26.07,95.65 26.07,96.29 D3.2
  other vias: 26.29,91.46 26,96.31
LIN_NEG_B  (via drill 0.35)
  Bottom 0.305: D4.2 5.15,85.53 3.3,87.38 3.3,89.57 R16.1
  other vias: 5.15,82.44 3.21,89.66
LIN_POS_A  (via drill 0.35)
  Top 0.305: R55.1 23.96,84.49 v23.88,84.58
  Bottom 0.305: v23.88,84.58 23.88,94.23 24.13,94.49 24.13,96.24 D3.1
  other vias: 24.1,96.31
LIN_POS_B
  Top 0.305: R87.1 D4.1
LINBIASA_1
  Top 0.305: JP4.3 R121.2
LINBIASA_2
  Top 0.305: R53.1 JP4.2
LINBIASA_3
  Top 0.305: JP4.1 R122.1
LINBIASB_1
  Top 0.305: JP4.7 R117.2
LINBIASB_2
  Top 0.305: JP4.6 44.16,89.92 R73.1
LINBIASB_3
  Top 0.305: R118.1 JP4.5
N$1  (via drill 0.35)
  Top 0.305: v5.08,25.91 10.92,25.91 11.68,25.15 IC14.10
  Bottom 0.305: R43.1 2.54,81 2.54,72.64 4.74,70.45 R41.1 4.74,44.54 5.08,44.2 5.08,42.16 4.13,41.21 4.13,26.86 v5.08,25.91
  other vias: 4.74,59.94 2.88,81.34
N$2  (via drill 0.35)
  Top 0.305: v24.19,66.55 22.01,66.55 R4.2 21.76,66.8 IC1.8 | D3.3 v25.15,98.51
  Bottom 0.305: v25.15,98.51 25.15,84.45 24.13,83.12 v24.19,66.55
N$3  (via drill 0.35)
  Top 0.305: R103.1 40.11,17.93 v39.69,18.23 | v39.69,22.86 35.56,22.86 35.05,23.37 IC12.10 | R98.1 v34.42,28.45
  Bottom 0.305: v39.69,18.23 v39.69,22.86 | v34.42,28.45 35.05,27.88 IC12.10
  other vias: 35.05,24.44
N$4
  Top 0.305: 47.4,13.72 48.26,13.72 | 47.4,13.72 JP8.9 41.83,13.72 Q10.3 | JP8.10 47.4,13.72
N$5  (via drill 0.35)
  Top 0.305: R24.2 15.2,8.42 v15.24,8.38 | v15.24,4.83 18.54,4.83 19.3,4.06 20.77,4.06 IC3.1
  Bottom 0.305: v15.24,8.38 v15.24,4.83
N$6  (via drill 0.35)
  Top 0.305: 7.32,47.78 R6.1 v7.18,47.88
  Bottom 0.305: C3.1 7.32,47.7 v7.18,47.88
  other vias: 7.32,45.34
N$7
  Top 0.305: Q9.3 44.75,24.05 JP8.1 JP8.2
N$8  (via drill 0.35)
  Top 0.305: v7.87,21.62 v2.92,21.62 | v5.4,1.52 7.28,1.52 R17.1
  Bottom 0.305: 7.87,24.13 IC14.13 | R25.2 7.87,27.47 IC14.13 | IC14.13 v7.87,21.62 | v2.92,21.62 2.95,9.56 5.4,7.87 v5.4,1.52
  other vias: 7.87,24.19 8.22,28.13
N$9  (via drill 0.35)
  Top 0.305: v22.1,6.92 18.46,6.92 v18.01,7.37
  Bottom 0.203: 18.76,13.08 18.76,17.34 R9.2
  Bottom 0.305: IC3.2 v22.1,6.92 | v18.01,7.37 18.01,12.33 18.76,13.08
  other vias: 22.1,4 18.58,17.37
N$10  (via drill 0.35)
  Top 0.305: R26.1 22.1,52.24 R27.1 | v11.68,22.03 16.51,22.03 16.64,22.16 19.56,22.16 v19.68,22.29
  Bottom 0.305: R27.1 21.93,51.65 21.08,50.8 21.08,32.26 20.07,31.24 20.07,22.67 v19.68,22.29 | v11.68,22.03 IC14.5
  other vias: 21.93,52.07 11.68,18.99
N$11  (via drill 0.35)
  Bottom 0.305: IC14.1 6.67,18.93 6.67,17.4 6.77,17.3 R39.1 R15.2
  other vias: 6.77,15.94 6.6,18.99 6.77,13.02
N$12  (via drill 0.35)
  Top 0.305: IC1.13 21.5,73.15 R21.1 | R14.1 5.33,73.41 6.6,74.68 11.18,74.68 11.94,75.44 v19.05,75.44
  Bottom 0.305: IC1.13 19.05,73.21 v19.05,75.44 19.05,76.45 19.84,77.56 R31.2
  other vias: 19.11,73.15 19.84,77.85
N$13  (via drill 0.35)
  Top 0.305: R113.1 3.49,14.86 3.81,14.54 15.56,14.54 16.51,15.49 v23.81,15.49 | v23.81,23.5 28.78,23.46 29.54,22.82 29.53,22.8 v31.11,22.8 32.64,22.8 v33.12,22.51
  Bottom 0.203: R114.2 31.75,2.5 31.75,8.38 31.5,8.64 31.5,14.99 33.12,16.32 v33.12,22.51
  Bottom 0.305: v31.11,22.8 31.11,24.32 IC12.13 | v23.81,23.5 v23.81,15.49
  other vias: 31.24,24.44 31.81,2.41
N$14  (via drill 0.35)
  Top 0.305: v9.21,6.29 v26.99,6.29
  Bottom 0.305: v26.99,6.29 26.99,4.2 IC3.6 | R48.1 8.64,29.97 9.4,29.21 9.4,7.37 9.14,7.11 9.14,6.35 v9.21,6.29
  other vias: 27.18,4 8.64,33.87
N$15  (via drill 0.35)
  Top 0.305: IC5.13 22.01,38.61 R28.1 22.19,38.61 23.62,38.61 23.94,38.23 v26.96,38.23
  Bottom 0.305: R29.2 v26.96,38.23
  other vias: 26.92,33.62
N$16  (via drill 0.35)
  Top 0.305: v9.05,50.25 12.05,50.25 IC2.7 | R6.2 v8.95,47.91
  Bottom 0.305: R5.2 9.18,47.83 v8.95,47.91 8.95,50.09 v9.05,50.25
  other vias: 9.18,40.58
N$17  (via drill 0.35)
  Top 0.305: R4.1 21.5,68.07 IC1.9 v16.51,68.07 | R53.2 42.16,79.76 40.89,78.49 36.83,78.49 36.07,79.25 16.51,79.25 16,78.74 14.38,78.74 R3.2
  Bottom 0.305: R3.2 14.31,82.11 R8.1 | v16.51,68.07 16.51,75.69 14.22,77.98 14.22,78.72 R3.2 | 14.48,78.64 R3.2
  other vias: 14.31,78.8 14.25,82.17
N$18  (via drill 0.35)
  Top 0.305: R57.2 21.11,2.03 21.5,1.52 27.18,1.52 27.46,1.3 v28.45,1.3
  Bottom 0.305: v28.45,1.3 IC3.7
  other vias: 28.45,4
N$19  (via drill 0.35)
  Bottom 0.305: C5.1 21.96,46.46 R11.1
  other vias: 21.96,42.89 21.93,46.48
N$20  (via drill 0.35)
  Top 0.305: R10.1 11.94,52.52 IC2.5 14.1,52.7 v14.22,52.58 | v15.75,33.53 IC5.6 12.19,33.53 11.82,33.89 C4.2
  Bottom 0.305: v14.22,52.58 14.22,43.18 16,41.4 16,33.78 v15.75,33.53
N$21  (via drill 0.35)
  Top 0.305: IC5.7 14.05,32.14 v13.37,32.14 C4.1 11.15,32.17 R48.2 5.93,32.17 5.84,32.26 v5.08,32.26 | v5.84,52.54 7.63,52.54 R10.2
  Bottom 0.305: v5.08,32.26 4.76,32.58 4.76,40.58 5.71,41.85 5.71,44.58 5.33,44.96 5.33,52.03 v5.84,52.54 | R20.1 12.87,31.64 v13.37,32.14
  other vias: 12.87,30.04
N$22  (via drill 0.35)
  Top 0.305: R39.2 10.33,15.94 R42.1
  Bottom 0.305: R39.2 8.47,16.87 7.94,17.4 7.94,18.93 IC14.2
  other vias: 8.47,15.94 7.87,18.99
N$23  (via drill 0.35)
  Top 0.305: IC2.10 19.18,50.16 19.56,49.78 R7.2
  Bottom 0.305: R7.2 R11.2
  other vias: 20.23,49.78 20.23,46.48
N$24  (via drill 0.35)
  Top 0.305: IC5.14 v20.07,39.88 21.76,39.88 R28.2
  Bottom 0.305: v20.07,39.88 20,39.81 20,31.96 18.1,30.06 18.1,22.16 18.48,21.78 R126.1
  other vias: 18.48,21.11
N$25
  Top 0.305: C11.1 41.74,47.5 R47.1
N$26  (via drill 0.35)
  Top 0.254: R104.2 33.19,9.06 31.5,7.62 v27.18,7.62
  Bottom 0.254: v27.18,7.62 IC3.9
  other vias: 27.18,9.2
N$27  (via drill 0.35)
  Bottom 0.203: 21.34,14.99 21.34,13.46 22.1,12.7 IC3.13
  Bottom 0.305: R109.1 22.71,16.9 21.37,15.81 21.34,14.99
  other vias: 22.71,26.86 22.1,9.2
N$28  (via drill 0.35)
  Top 0.305: IC7.2 IC7.1 | v30.45,96.1 R33.2
  Bottom 0.305: IC7.1 v30.45,96.1
  other vias: 30.42,92.2
N$29  (via drill 0.35)
  Bottom 0.305: R35.1 9.31,64.94 C2.1
  other vias: 9.31,62.64 9.29,65.15
N$30  (via drill 0.35)
  Top 0.305: R34.2 IC2.2
  Bottom 0.305: 11.01,62.57 R35.2 10.92,62.4 10.92,61.72 9.74,60.54 R34.2 9.65,56.6
  other vias: 11.01,62.64 9.74,56.52
N$31
  Top 0.305: IC7.6 28.96,85.85 28.61,86.19 R18.1 R55.2
N$32  (via drill 0.35)
  Top 0.305: IC10.7 9.95,84.58 R92.2 | R88.2 v9.91,95.5
  Bottom 0.305: v9.91,95.5 9.91,84.75 R92.2
  other vias: 9.84,84.68
N$33  (via drill 0.35)
  Top 0.305: v37.15,46.46 R45.2 37.91,46.42 39.05,47.56 39.6,47.56 R47.2
  Bottom 0.305: 36.58,50.36 v36.64,50.42 36.64,47.44 37.15,46.93 v37.15,46.46
N$34  (via drill 0.35)
  Bottom 0.305: R90.1 27.09,59.73 C19.1
  other vias: 27.09,56.77 26.87,60.2
N$35
  Top 0.305: R13.1 46.74,3.3 47.5,4.06 OFFSET_LINA.3
N$36
  Top 0.305: R2.1 1.33,9.46 OFFSET_REF.3
N$37  (via drill 0.35)
  Bottom 0.305: CLAMP_REF.3 R62.1
  other vias: 48.77,35.65
N$38  (via drill 0.35)
  Top 0.305: C1.1 48.63,6.46 OFFSET_LINA.2 | v49.02,31.24 v46.74,31.24
  Bottom 0.305: OFFSET_LINA.2 48.77,7.37 47.5,8.64 47.5,10.92 49.02,12.45 v49.02,31.24 | v46.74,31.24 46.74,34.22 IC4.5
  other vias: 46.86,34.35
N$39
  Top 0.305: R32.2 30.32,89.76 IC7.3
N$40  (via drill 0.35)
  Top 0.305: OFFSET_REF.2 v4.06,6.86 | R17.2 4.09,3.14 C9.1
  Bottom 0.305: v4.06,6.86 C9.1
  other vias: 4.06,3.16
N$41  (via drill 0.35)
  Top 0.305: v18.73,22.92 15.05,22.92 14.62,22.49 13.32,22.49 13.02,22.8 13.02,24.13 IC14.9
  Bottom 0.305: IC14.9 12.95,27.47 R19.2 | R23.1 19.15,25.21 R40.1 19.03,23.21 v18.73,22.92
  other vias: 12.95,24.19 12.93,27.5 19.15,27.5 19.03,25.08
N$42  (via drill 0.35)
  Top 0.254: v30.8,9.14 28.51,9.14 IC3.8
  Bottom 0.254: R105.1 30.9,9.04 v30.8,9.14
  other vias: 30.9,5.65
N$43  (via drill 0.35)
  Top 0.305: v20.83,11.18 28.11,11.18 R111.1
  Bottom 0.305: IC3.14 v20.83,11.18
  other vias: 20.83,9.2
N$44  (via drill 0.35)
  Top 0.305: IC6.12 38.23,52.96 38.86,52.32 R49.1 | v36.32,44.7 v39.88,44.7
  Bottom 0.305: R49.1 39.51,52.3 C14.2 39.37,50.15 39.37,48.77 39.88,48.26 v39.88,44.7 | IC8.9 36.38,44.64 v36.32,44.7
  other vias: 39.51,50.29 39.54,52.32 36.38,33.27
N$45  (via drill 0.35)
  Top 0.305: R96.1 43.28,61.02 v37.6,61.02 R95.1 | v36.2,31.05 v39.47,31.05 | v38.42,21.84 37.47,21.84 36.91,22.4 35.12,22.4 v35.05,22.48
  Bottom 0.305: v37.6,61.02 37.6,56.9 37.47,56.77 37.47,47.26 37.78,46.94 37.78,44.78 36.88,43.88 36.88,41.78 37.02,41.64 37.02,31.88 v36.2,31.05 | v39.47,31.05 39.47,30.43 39.36,30.32 39.26,30.25 39.05,30.04 39.05,27.88 38.42,27.24 v38.42,21.84 | v35.05,22.48 IC12.5
  other vias: 35.05,19.24
N$46  (via drill 0.35)
  Top 0.305: 39.18,32 IC8.8 | 39.18,32 39.2,32 | 40.6,32.17 v40.64,32.26 39.54,32.26 R68.1 39.37,32.2 39.18,32 | R104.1 38.71,10.76 v39.05,10.73
  Bottom 0.305: R49.2 41.24,50.32 C14.1 41.26,45.96 40.58,45.28 40.58,34.86 40.64,34.7 v40.64,32.26 40.64,30.89 39.69,29.88 39.69,27.56 39.05,26.92 v39.05,10.73
  other vias: 41.24,52.32 41.26,50.29
N$47
  Top 0.305: C15.1 R56.1
N$48  (via drill 0.35)
  Top 0.305: R56.2 28.79,49.62 29.46,50.29 v31.31,50.29 IC6.7
  Bottom 0.305: R54.2 31.41,50.19 v31.31,50.29
  other vias: 31.41,46.48
N$49  (via drill 0.35)
  Top 0.305: 19.16,33.64 C12.2 23.85,33.64 R36.1 | 19.16,33.64 v19.05,33.53 | IC2.12 18.92,52.7 v19.05,52.58 | IC5.9 19.27,33.53 19.16,33.64
  Bottom 0.305: v19.05,52.58 19.05,33.84 v19.05,33.53
N$50
  Top 0.305: R112.1 LED_REF.3
N$51  (via drill 0.35)
  Top 0.305: IC5.8 21.48,32.26 C12.1 23.85,31.89 R36.2 R29.1 | R9.1 v21.84,17.37 | v22.08,23.88 22.08,23.92 22.86,24.7 26,24.7 v26.99,25.72
  Bottom 0.305: v21.84,17.37 21.84,23.64 v22.08,23.88 | v26.99,25.72 26.99,31.85 R29.1
  other vias: 26.92,31.92
N$52  (via drill 0.35)
  Top 0.305: v33.27,52.83 31.56,52.83 IC6.5 | v33.59,33.31 IC8.6
  Bottom 0.305: v33.27,52.83 33.11,52.67 R64.1 33.11,41.36 C16.2 33.13,38.3 33.75,37.85 33.75,33.46 v33.59,33.31
  other vias: 33.11,44.26 33.13,41.34
N$53  (via drill 0.35)
  Top 0.305: R18.2 30.33,84.49 IC7.7
  Bottom 0.305: R58.2 27.6,84.34 R18.2
  other vias: 27.6,82.17 27.43,84.49
N$54  (via drill 0.35)
  Bottom 0.305: 18.07,62.62 C7.1 18.02,62.6 18.03,62.23 18.03,60.11 R60.1
  other vias: 18.2,59.94 18.11,62.61
N$55  (via drill 0.35)
  Top 0.305: R60.2 R59.2 | IC2.15 19.18,56.52 v19.27,56.43
  Bottom 0.305: v19.27,56.43 19.27,58.13 19.81,58.67 19.81,59.86 R60.2
  other vias: 19.9,59.94
N$56
  Top 0.305: R63.2 47.75,45.72 48.77,44.7 CLAMP_REF.1
N$57  (via drill 0.35)
  Top 0.305: C10.1 48.56,41.2 CLAMP_REF.2
  Bottom 0.305: 45.72,29.28 IC4.3 45.59,35.62 45.88,35.91 45.88,41.1 C10.1
  other vias: 45.97,41.2 45.59,29.15
N$58  (via drill 0.35)
  Top 0.305: R90.2 IC6.2
  Bottom 0.305: R90.2 R89.2
  other vias: 28.79,56.77 28.79,54.36
N$59  (via drill 0.35)
  Top 0.203: C16.1 30.61,41.34 30.29,41.02 v28.7,41.02
  Top 0.305: 28.23,26.86 R66.1 27.56,26.8 27.11,27.24 25.69,27.24 25.3,26.86 R109.2 | v28.45,32 IC8.7
  Bottom 0.305: R66.1 28.3,31.85 v28.45,32 28.45,32.13 28.26,32.32 28.26,39.69 28.7,40.13 v28.7,41.02 | C16.1 31.38,44.23 R64.2
  other vias: 28.3,26.8 31.38,41.34 31.41,44.26
N$60  (via drill 0.35)
  Top 0.305: IC8.13 38.35,38.35 38.77,37.85 39.71,37.85 R67.1
  Bottom 0.305: R68.2 39.37,35.31 39.62,35.59 R67.1
  other vias: 39.37,34.12 39.59,38.01
N$61  (via drill 0.35)
  Top 0.305: IC8.14 36.47,39.71 | IC8.14 38.73,39.62 39.02,39.37 39.85,39.37 R67.2 | v24.23,30.19 27.34,30.19 28.42,31.27 v34.8,31.27 | v35.4,39.62 IC8.14
  Bottom 0.305: R115.1 25.15,24.89 24.19,26.16 v24.23,30.19 | v34.8,31.27 34.86,39.31 v35.4,39.62
  other vias: 25.15,21.17
N$63
  Top 0.305: C20.1 5.23,17.49 R113.2 1.31,17.49 LED_REF.2
N$64
  Top 0.305: IC10.2 IC10.1 11.26,92.2 R83.2
N$65
  Top 0.305: D6.3 47.3,74.19 R76.2 40.42,74.17 IC9.14
N$66  (via drill 0.35)
  Top 0.305: R76.1 38.51,72.49 38.1,72.9 IC9.13 v33.27,72.9 | R75.2 27.09,65.37 27.43,65.02 32,65.02 32.26,65.28 33.2,65.28 v33.27,65.35
  Bottom 0.305: v33.27,72.9 v33.27,65.35 33.27,64.01 31.96,62.7 R82.1
  other vias: 31.96,59.94
N$69  (via drill 0.35)
  Top 0.305: R79.2 6.2,80.14 D4.3 | IC9.8 v38.86,66.55
  Bottom 0.305: v38.86,66.55 38.86,78.74 38.35,79.25 38.35,80.05 R79.2
  other vias: 38.27,80.14
N$74  (via drill 0.35)
  Top 0.305: R73.2 40.89,90.04 v40.77,89.92 | v39.62,67.82 IC9.9
  Bottom 0.305: v40.77,89.92 40.77,88.96 40.01,88.2 40.01,83.35 40.13,83.22 R81.1 R79.1 R78.2 39.97,76.29 39.56,75.57 39.56,74.42 v39.62,67.82
  other vias: 39.97,83.38 39.97,80.14 39.97,76.96
N$77
  Top 0.305: R16.2 IC10.3
N$78  (via drill 0.35)
  Bottom 0.305: R85.1 41.3,63.6 C17.1
  other vias: 41.3,59.25 41.32,63.63
N$79  (via drill 0.35)
  Top 0.305: IC6.15 39.35,56.77 R84.2
  Bottom 0.305: R85.2 39.6,57.02 R84.2
  other vias: 39.6,59.25 39.47,56.74
N$80
  Top 0.305: IC10.6 11.68,85.85 11.18,86.36 9.87,86.36 R92.1 7.11,86.38 R87.2
N$83  (via drill 0.35)
  Bottom 0.305: R94.1 12.87,60.11 11.94,59.18 11.94,57.98 IC2.1
  other vias: 12.87,62.48 12.13,57.78
N$86  (via drill 0.35)
  Top 0.254: 31.75,16.79 R100.2
  Top 0.305: R100.2 32.03,16.51 34.86,16.51 v34.92,16.45 | v35.05,14.67 40.77,14.67 40.96,14.86 43.31,14.86 v43.43,14.99 | R101.1 43.53,26.26 v43.43,26.16
  Bottom 0.305: v43.43,26.16 v43.43,14.99 | IC12.2 31.24,18.23 31.43,18.03 31.43,16.79 R100.2 | v34.92,16.45 34.92,14.79 v35.05,14.67
  other vias: 31.52,16.67 31.24,19.24
N$87  (via drill 0.35)
  Top 0.305: R100.1 29.82,15.9 30.23,15.49 v34.29,15.49 | 35.15,12.95 R102.2
  Bottom 0.305: IC12.1 29.97,18.16 29.84,18.03 29.84,16.73 R100.1 | v34.29,15.49 34.29,13.46 34.67,13.08 R102.2
  other vias: 35.28,13.08 29.82,16.67 29.97,19.24
N$91  (via drill 0.35)
  Top 0.305: R97.1 20.77,22.1 21.46,22.8 28.57,22.8 29.53,21.84 35.94,21.84 v36.32,21.46 | R107.1 v42.74,69.34 | v41.66,45.47 v39.18,45.47
  Bottom 0.305: v36.32,21.46 IC12.9 36.23,24.53 R108.2 36.23,28.39 36.32,28.48 36.32,29.97 38.1,31.75 38.1,40.13 39.18,41.21 v39.18,45.47 | v42.74,69.34 42.74,46.54 v41.66,45.47
  other vias: 36.32,24.44 36.23,28.13
N$94  (via drill 0.35)
  Top 0.305: IC1.14 21.76,74.42 21.67,74.51 R21.2 22.84,74.51 v23.24,74.1 | v23.62,42.67 24.79,42.67 D5.3
  Bottom 0.305: v23.24,74.1 23.24,66.17 25.4,64.33 25.4,59.44 26.16,58.67 26.16,48.26 23.62,45.72 v23.62,42.67
N$97
  Top 0.305: IC6.1 31.31,58.17 26.16,58.17 25.15,57.15 24.54,57.15 R110.1
OFFSET_LIN  (via drill 0.35)
  Top 0.305: IC4.6 IC4.7 | v43.69,94.49 40.13,94.49 v39.12,93.47 | v38.92,89.66 IC7.12 35.43,89.47 v33.97,89.47 | IC10.10 21.84,87.12 22.35,87.63 v28.19,87.63 | v28.19,97.54 33.27,97.54 33.75,97.12 v39.08,97.12 | IC7.10 34.1,87.12 v33.97,87.25
  Bottom 0.305: IC10.10 IC10.12 | v43.69,94.49 43.69,51.31 44.77,50.23 44.77,42.67 44.45,42.35 44.45,34.48 IC4.7 | v38.92,89.66 39.12,90.17 v39.12,93.47 v39.08,97.12 | v28.19,87.63 v28.19,97.54 | v33.97,87.25 v33.97,89.47
  other vias: 19.11,87.12 19.11,89.66 44.32,34.35
OFFSET_REF  (via drill 0.35)
  Top 0.305: R46.2 v20.79,19.47 R97.2 20.77,18.99 20.32,18.54 17.3,18.54 v17.18,18.67 | v6.6,20.96 v14.13,20.96 14.16,20.92 v17.11,20.92
  Bottom 0.305: R25.1 6.6,28.04 IC14.14 v6.6,20.96 | 20.77,19.44 v20.79,19.47 20.85,19.53 R23.2 | 14.19,20.84 v14.13,20.96 14.13,14.86 15.05,13.94 15.05,12.79 R106.2 | v17.18,18.67 17.18,20.86 v17.11,20.92
  other vias: 6.6,24.19 6.52,28.13 15.07,12.76 20.85,27.5
OUT_A  (via drill 0.35)
  Bottom 0.305: R126.2 18.48,18.67 17.43,17.56 17.46,14.16 JP7.1
  other vias: 18.48,19.41
OUT_B  (via drill 0.35)
  Top 0.305: v27.69,16.89 v25.15,16.89
  Bottom 0.305: R115.2 v25.15,16.89 | v27.69,16.89 JP7.5
  other vias: 25.15,19.47
POT_EXPA_1  (via drill 0.35)
  Top 0.305: R22.2 v5.91,68.07 | JP2.4 v5.59,57.4 6.86,58.67 11.68,58.67 12.7,59.69 v15.49,59.69 | IC1.12 v15.88,71.88
  Bottom 0.305: v5.91,68.07 5.91,65.34 5.59,65.02 v5.59,57.4 | v15.88,71.88 15.88,65.66 15.56,65.34 15.56,59.75 v15.49,59.69
POT_EXPA_3  (via drill 0.35)
  Top 0.305: v0.76,73.41 R14.2
  Bottom 0.305: v0.76,73.41 0.76,55.88 1.78,54.86 JP2.3
POT_EXPB_1  (via drill 0.35)
  Top 0.305: R77.2 32.03,62.55 | IC9.12 38.86,71.63 39.12,71.37 v44.39,71.37 | JP2.2 4.06,52.32 5.33,51.05 v9.14,51.05 | v11.43,60.45 16.51,60.45 17.27,61.21 31.5,61.21 32,61.72 32,62.52 32.03,62.55 | v44.39,63.18 44.2,62.99 43.43,62.99 42.99,62.55 32.03,62.55
  Bottom 0.305: v44.39,63.18 v44.39,71.37 | v9.14,51.05 9.14,53.85 10.92,55.63 10.92,59.94 v11.43,60.45
POT_EXPB_3  (via drill 0.35)
  Top 0.305: JP2.1 4.57,49.78 5.08,50.29 v8.13,50.29 | v8.38,43.94 12.7,43.94 13.72,44.96 22.35,44.96 23.62,46.23 v29.72,46.23
  Bottom 0.305: v8.13,50.29 8.13,44.2 v8.38,43.94 | v29.72,46.23 29.72,59.4 v30.27,59.94
POT_LINA_1  (via drill 0.35)
  Top 0.305: v4.83,78.74 8.42,78.74 R12.2 | v12.19,65.79 v19.3,65.79 | JP2.9 5.08,70.1 5.33,70.36 | 5.33,70.36 5.59,70.1 v12.19,70.1 | 5.33,70.36 v5.37,70.36
  Bottom 0.305: v12.19,70.1 v12.19,65.79 | v19.3,65.79 19.3,69.15 IC1.10 | v5.37,70.36 5.37,76.93 4.83,77.47 v4.83,78.74
  other vias: 19.11,69.34
POT_LINA_3  (via drill 0.35)
  Top 0.305: R8.2 9.27,82.17 v8.64,81.53 | v9.14,66.29 5.84,66.29 4.57,67.56 JP2.8
  Bottom 0.305: v8.64,81.53 8.64,77.47 9.14,76.96 v9.14,66.29
POT_LINB_1  (via drill 0.35)
  Top 0.305: JP2.7 4.57,65.02 5.59,64.01 20.26,64.01 21.27,65.02 24.45,65.02 25.08,64.39 25.84,64.39 v26.23,64.77 26.42,64.77 26.67,64.52 33.53,64.52 34.04,64.01 35.56,64.01 v35.75,64.2
  Bottom 0.305: 26.16,74 R80.2 26.23,74.07 v26.23,64.77 | v35.75,64.2 35.75,67.76 36.32,68.33 36.32,69.03 IC9.10
  other vias: 26.33,74.17 36.38,69.09
POT_LINB_3  (via drill 0.35)
  Top 0.305: v17.59,82.36 18.61,83.38 R81.2 | v16.32,61.21 6.6,61.21 5.33,62.48 JP2.6
  Bottom 0.305: v17.59,82.36 17.14,81.92 17.14,80.26 17.27,65.79 16.32,64.52 v16.32,61.21
UNIPOLAR_A
  Top 0.305: JP6.1 46.74,49.78 46.23,50.29 R119.1
UNIPOLAR_B
  Top 0.305: JP6.4 46.23,57.4 45.72,56.9 R120.1
V_REF  (via drill 0.35)
  Top 0.203: v28.19,58.93 29.27,58.93 29.53,58.67 38.04,58.67 v38.35,58.99
  Top 0.305: 21.24,76.65 11.11,76.65 10.67,76.2 9.68,76.2 R37.2 | 21.24,76.65 R91.2 | R86.2 v38.35,54.61 | v27.94,62.7 R61.2 | v27.18,75.95 25.4,75.95 24.89,75.44 22.45,75.44 21.24,76.65 | v42.16,32 48.51,32 v48.77,32.26 | v37.66,41.4 40.77,41.4 41.27,40.89 42.76,40.89 v42.86,41 | v6.35,5.65 v29.69,5.65 | v29.69,4.1 35.9,4.1 IC13.1 | v36.16,2.67 40.42,2.67 41.02,3.27 41.79,3.27 R13.2
  Bottom 0.305: v38.35,58.99 v38.35,54.61 38.35,44.7 37.66,44.01 v37.66,41.4 | v27.18,75.95 27.18,66.04 27.94,65.28 v27.94,62.7 27.94,59.18 v28.19,58.93 | R112.2 4.91,12.61 6.1,11.43 6.1,9.55 R2.2 6.18,5.82 v6.35,5.65 | v48.77,32.26 R62.2 | v42.86,41 42.55,40.68 42.55,32.96 42.16,32.58 v42.16,32 42.16,26.16 42.67,25.65 42.67,21.82 R93.1 42.44,19.79 42.93,19.3 42.93,15.75 41.62,14.45 41.62,3.3 41.72,3.2 R13.2 | v29.69,5.65 v29.69,4.1 | IC13.1 36.13,2.7 v36.16,2.67
  other vias: 42.44,21.59 4.91,20.07 48.77,33.95 6.18,9.46 41.82,3.3 36.13,4.23

## Text on the board
bNames: Rebel Technology | Dual VCA Rev 0